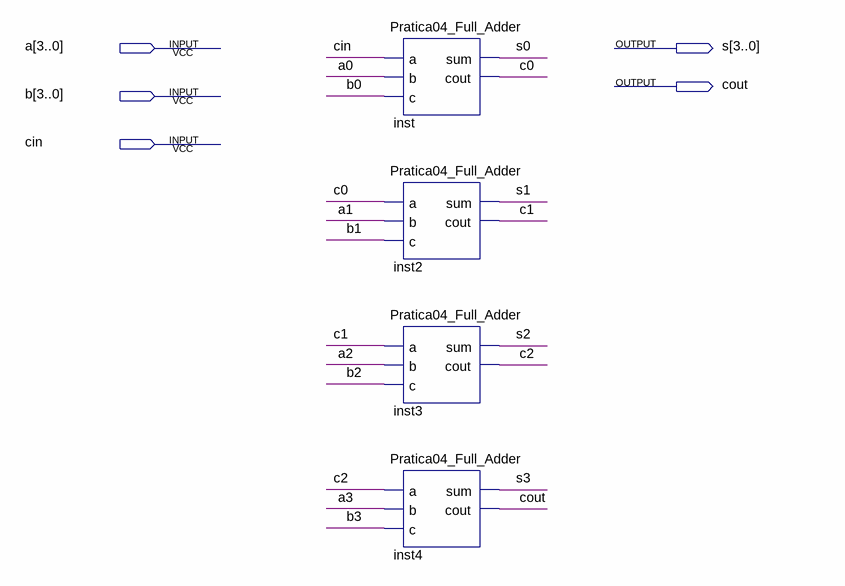
[diagram p0: schematic sheet]
// Quartus schematic Pratica04_Adder_4bits.bdf as structural Verilog: 4 symbols, 5 pins
module Pratica04_Adder_4bits (
  input  [3:0] a,
  input  [3:0] b,
  input  cin,
  output [3:0] s,
  output cout
);

  wire c0, c1, c2;

  Pratica04_Full_Adder inst (.a(cin), .b(a[0]), .c(b[0]), .sum(s[0]), .cout(c0));
  Pratica04_Full_Adder inst2 (.a(c0), .b(a[1]), .c(b[1]), .sum(s[1]), .cout(c1));
  Pratica04_Full_Adder inst3 (.a(c1), .b(a[2]), .c(b[2]), .sum(s[2]), .cout(c2));
  Pratica04_Full_Adder inst4 (.a(c2), .b(a[3]), .c(b[3]), .sum(s[3]), .cout(cout));
endmodule
